# EAGLE schematic ACCUM (EAGLE 9.3.0)
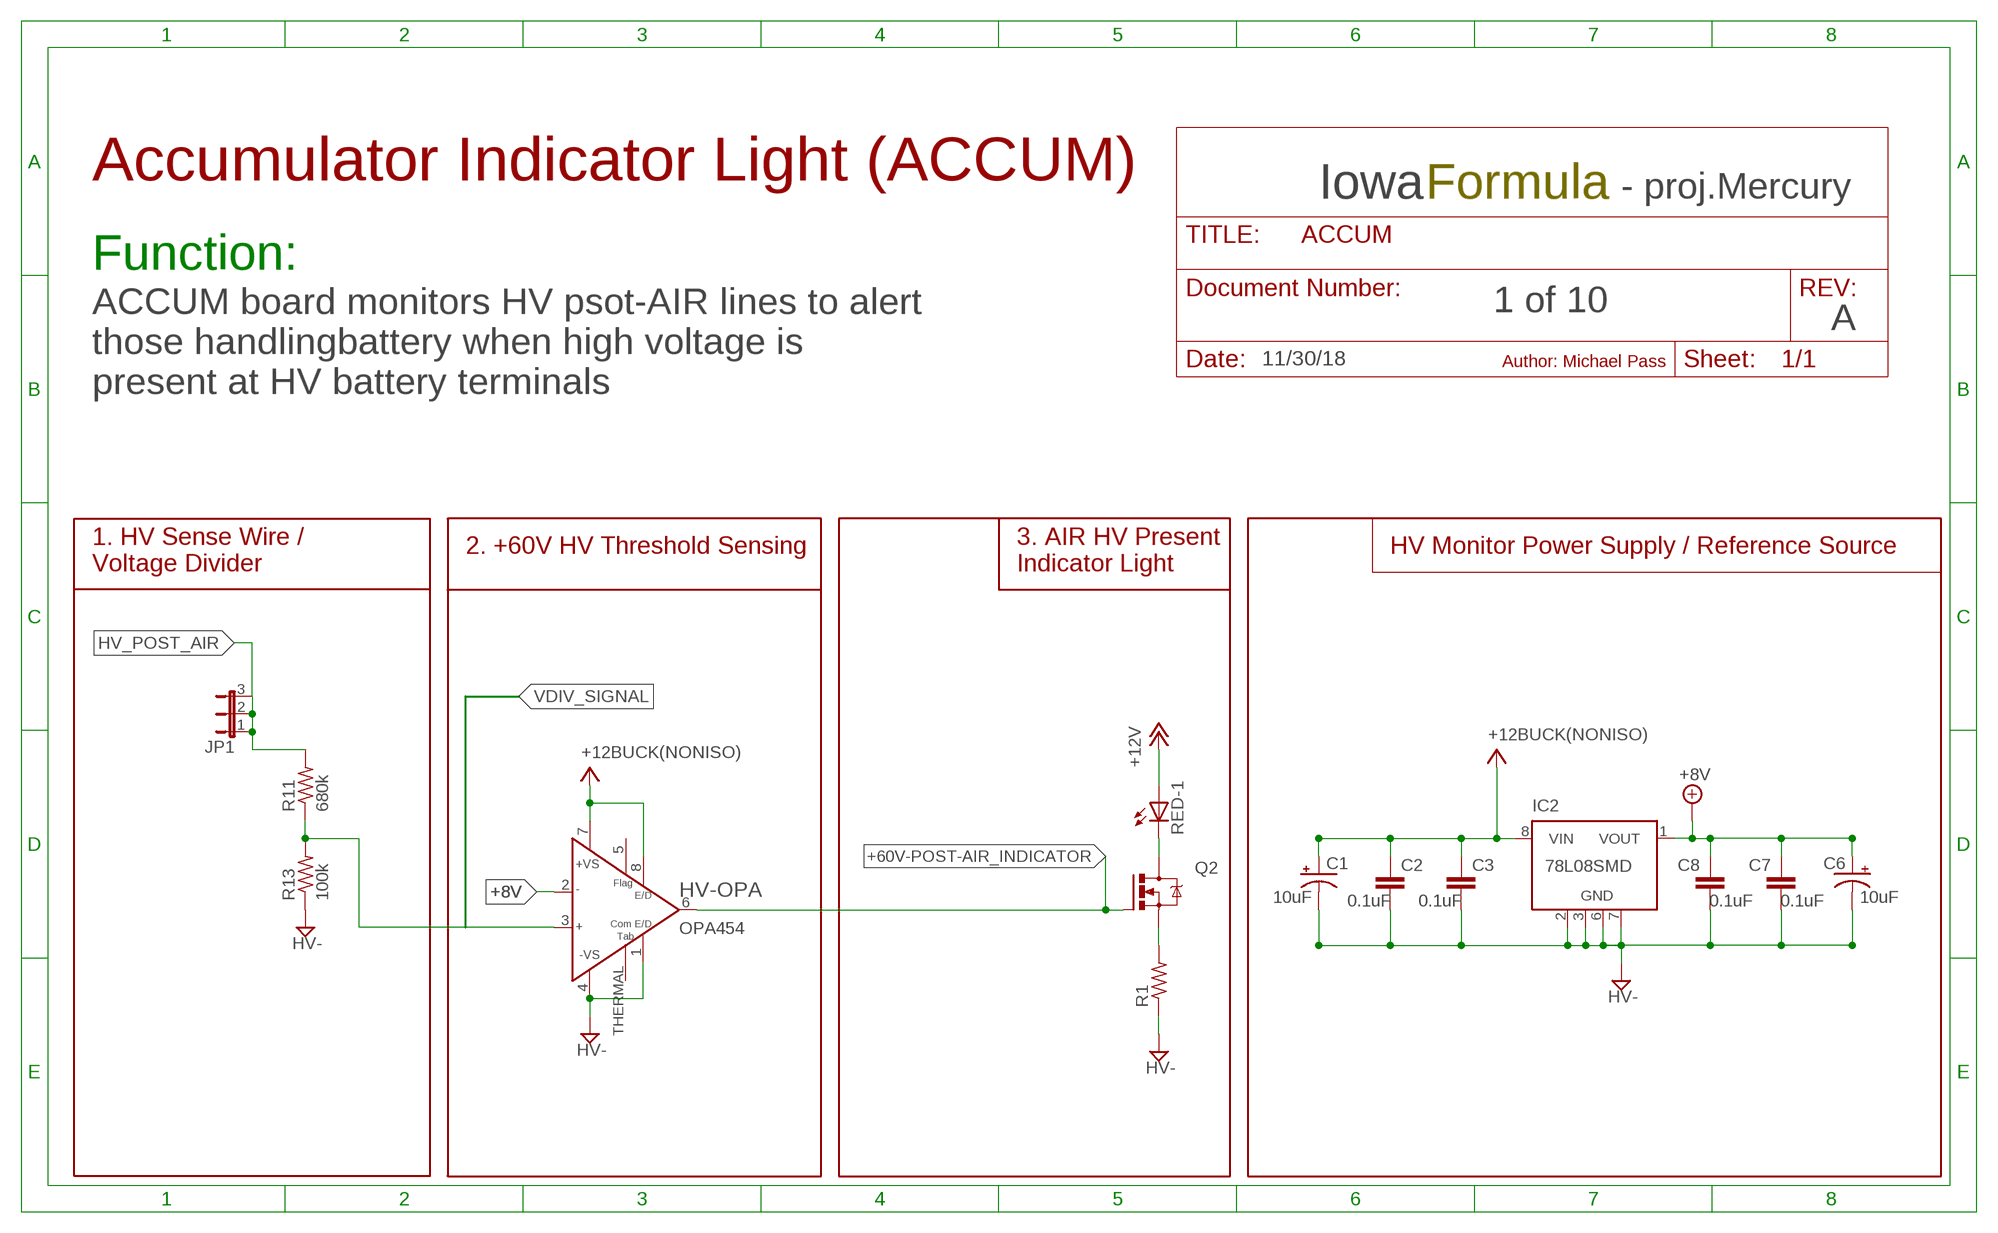
[diagram p0: schematic, sheet 1]

## Parts
C1  10uF  CPOL-US085CS-1AW  [085CS_1AW]
C2  0.1uF  C-EUC0805  [C0805]
C3  0.1uF  C-EUC0805  [C0805]
C6  10uF  CPOL-US085CS-1AW  [085CS_1AW]
C7  0.1uF  C-EUC0805  [C0805]
C8  0.1uF  C-EUC0805  [C0805]
HV-OPA  OPA454  [SO08GP]
IC2  78L08SMD  [SO08]
JP1  JP2W  [JP2W]
Q2  IRLZ44Z  [TO220BH]
R1  R-US_R0805  [R0805]
R11  680k  R-US_R0805  [R0805]
R13  100k  R-US_R0805  [R0805]
RED  LZR184  [LZR184]

## Nets
+8V: C6.+ C7.1 C8.1 HV-OPA.2(IN-) IC2.1(VOUT)
+12V: RED.A1(-1:A)
+60V-POST-AIR_INDICATOR: HV-OPA.6(OUT) Q2.G
GND: R1.1 R13.1 ; supply symbol labelled HV-
HV-: C1.- C2.2 C3.2 C6.- C7.2 C8.2 HV-OPA.1(E/DCOM) HV-OPA.4(-VS) IC2.2(GND) IC2.3(GND) IC2.6(GND) IC2.7(GND)
HV_POST_AIR: JP1.1 JP1.2 JP1.3 R11.2
N$2: Q2.D RED.K1(-1:C)
N$6: Q2.S R1.2
V+: C1.+ C2.1 C3.1 HV-OPA.7(+VS) HV-OPA.8(E/D) IC2.8(VIN) ; supply symbol labelled +12BUCK(NONISO)
VDIV_SIGNAL: HV-OPA.3(IN+) R11.1 R13.2
Unconnected: HV-OPA.5(STATUS) HV-OPA.THERMAL(E/DCOM1) IC2.4(NC) IC2.5(NC) RED.A2(-2:A) RED.A3(-3:A) RED.A4(-4:A) RED.K2(-2:C) RED.K3(-3:C) RED.K4(-4:C)

## Notes on the sheet
- Accumulator Indicator Light (ACCUM)
- Iowa | Formula | - proj.Mercury
- Function:
- 1 of 10
- A
- 11/30/18 | Author: Michael Pass
- ACCUM board monitors HV psot-AIR lines to alert
  those handlingbattery when high voltage is 
  present at HV battery terminals
- 2. +60V HV Threshold Sensing | HV Monitor Power Supply / Reference Source
- 1. HV Sense Wire / 
  Voltage Divider
- 3. AIR HV Present
  Indicator Light

## Library data of the parts
C1 C6 = rcl:CPOL-US: POLARIZED CAPACITOR, American symbol; SPICEPREFIX: C
C2 C3 C7 C8 = rcl:C-EU: CAPACITOR, European symbol; SPICEPREFIX: C
HV-OPA = OPA454:OPA454: TexasInstruments High-Voltage (100V), High-Current (50mA) Operatioanl Amplifier, G = 1 Stable http://focus.ti.com/lit/ds/symlink/opa454.pdf; AVAILABILITY: Unavailable; DESCRIPTION: High Voltage _100V_ High-Current _50mA_ Operational Amplifiers G=1 Stable; MF: Texas Instruments; MP: OPA454; PACKAGE: None; PRICE: None
IC2 = linear:78L*SMD: Positive VOLTAGE REGULATOR
JP1 = jumper:JP2W: JUMPER
Q2 = transistor-power:IRLZ44Z: N-Channel HEXFET® Power MOSFET Logic Level AUTOMOTIVE MOSFET Source: http://www.irf.com/product-info/datasheets/data/irlz44zpbf.pdf
R1 R11 R13 = rcl:R-US_: RESISTOR, American symbol; SPICEPREFIX: R
RED = led:LZR184: LED BLOCK 4 LEDs, Siemens